# EAGLE design pager (EAGLE 7.7.0)
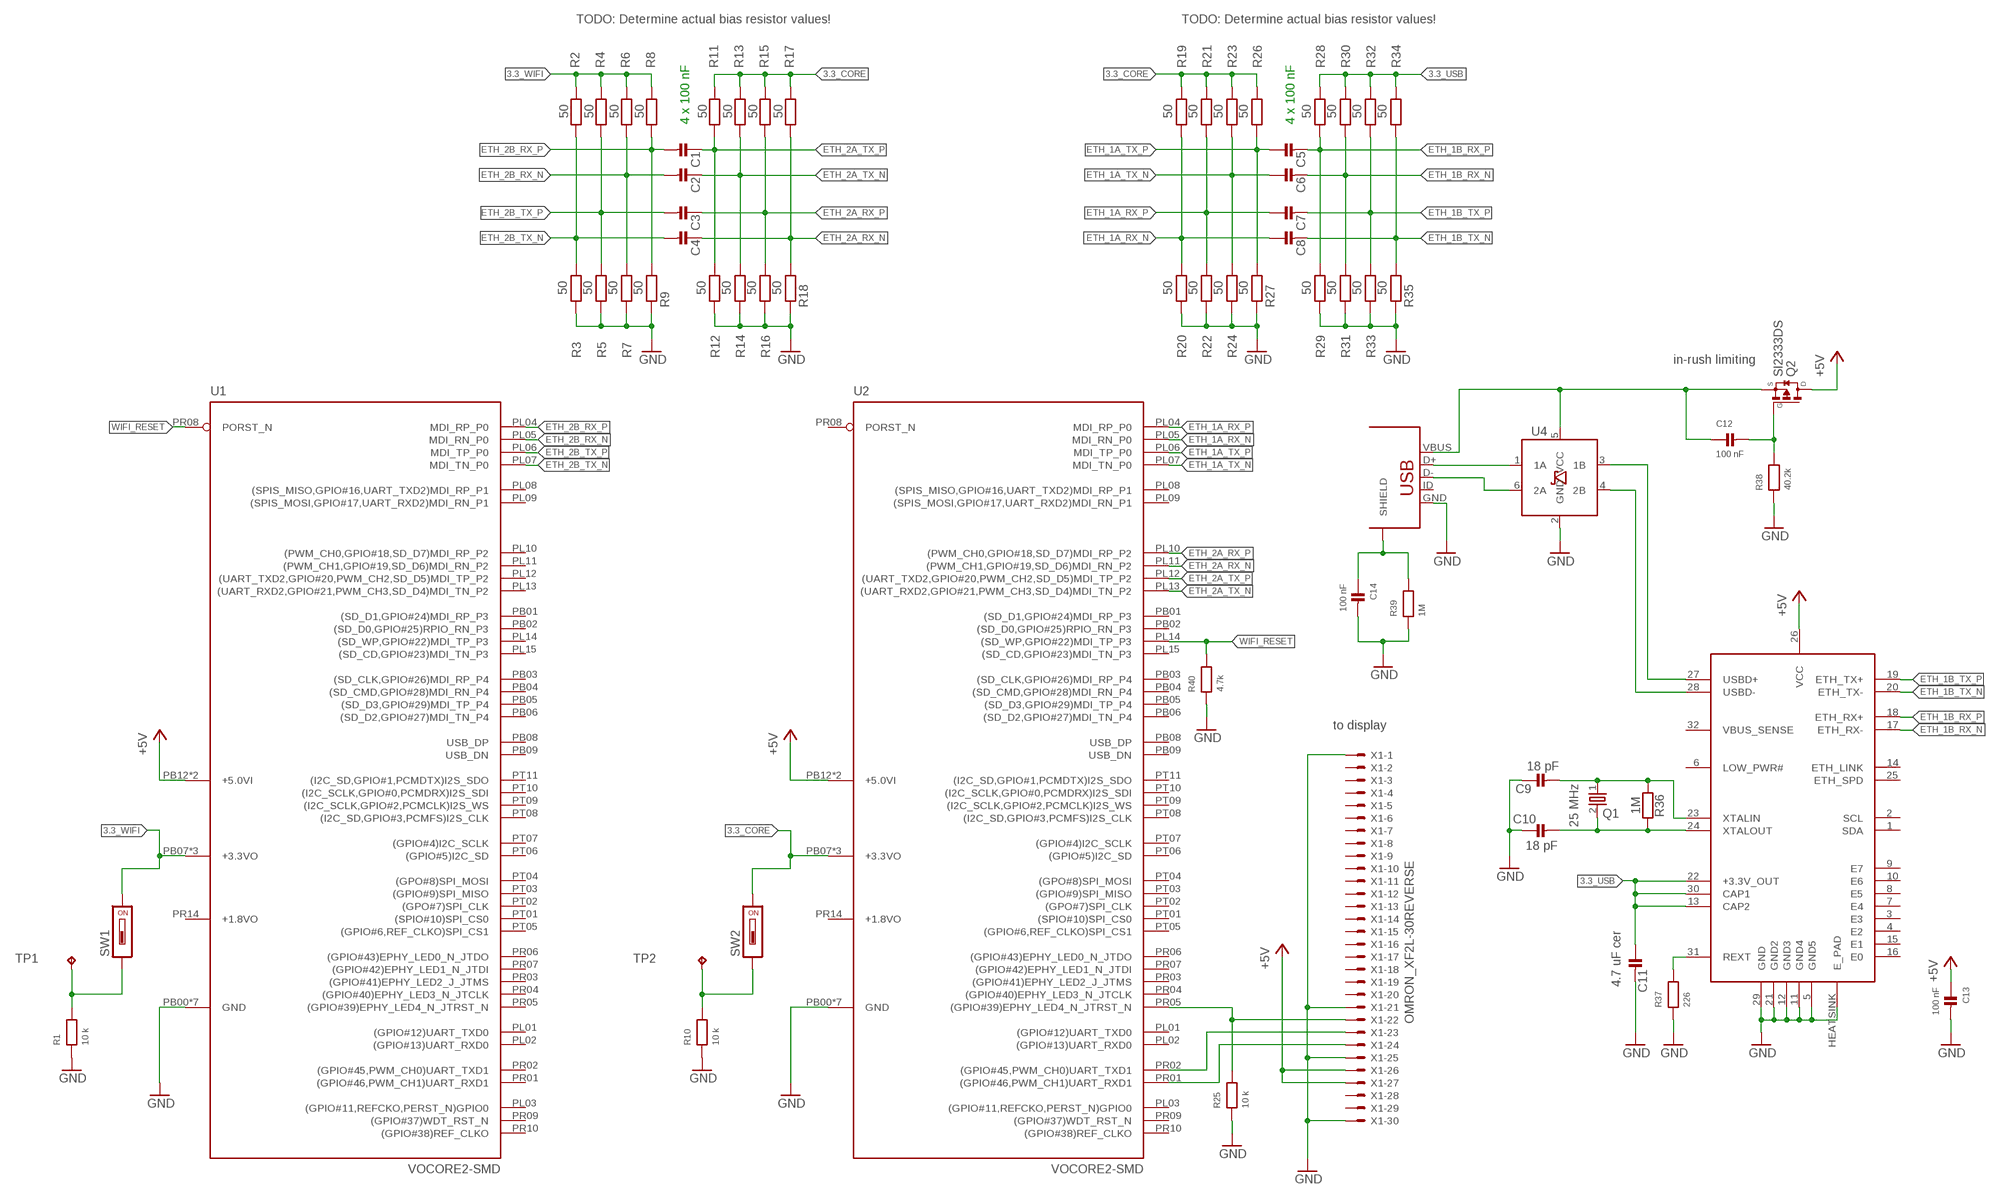
[diagram p0: schematic, sheet 1]

## Parts
C1  100 nF  CAP_CERAMIC_0402  [_0402]
C2  100 nF  CAP_CERAMIC_0402  [_0402]
C3  100 nF  CAP_CERAMIC_0402  [_0402]
C4  100 nF  CAP_CERAMIC_0402  [_0402]
C5  100 nF  CAP_CERAMIC_0402  [_0402]
C6  100 nF  CAP_CERAMIC_0402  [_0402]
C7  100 nF  CAP_CERAMIC_0402  [_0402]
C8  100 nF  CAP_CERAMIC_0402  [_0402]
C9  18 pF  CAP_CERAMIC_0402  [_0402]
C10  18 pF  CAP_CERAMIC_0402  [_0402]
C11  4.7 uF cer  CAP_CERAMIC_0603  [_0603]
C12  100 nF  CAP_CERAMIC_0402  [_0402]
C13  100 nF  CAP_CERAMIC_0402  [_0402]
C14  100 nF  CAP_CERAMIC_0402  [_0402]
Q1  25 MHz  XTAL-ABM3  [ABM3]
Q2  SI2333DS  [SOT23]
R1  10 k  RESISTOR_0402  [_0402]
R2  50  RESISTOR_0402  [_0402]
R3  50  RESISTOR_0402  [_0402]
R4  50  RESISTOR_0402  [_0402]
R5  50  RESISTOR_0402  [_0402]
R6  50  RESISTOR_0402  [_0402]
R7  50  RESISTOR_0402  [_0402]
R8  50  RESISTOR_0402  [_0402]
R9  50  RESISTOR_0402  [_0402]
R10  10 k  RESISTOR_0402  [_0402]
R11  50  RESISTOR_0402  [_0402]
R12  50  RESISTOR_0402  [_0402]
R13  50  RESISTOR_0402  [_0402]
R14  50  RESISTOR_0402  [_0402]
R15  50  RESISTOR_0402  [_0402]
R16  50  RESISTOR_0402  [_0402]
R17  50  RESISTOR_0402  [_0402]
R18  50  RESISTOR_0402  [_0402]
R19  50  RESISTOR_0402  [_0402]
R20  50  RESISTOR_0402  [_0402]
R21  50  RESISTOR_0402  [_0402]
R22  50  RESISTOR_0402  [_0402]
R23  50  RESISTOR_0402  [_0402]
R24  50  RESISTOR_0402  [_0402]
R25  10 k  RESISTOR_0402  [_0402]
R26  50  RESISTOR_0402  [_0402]
R27  50  RESISTOR_0402  [_0402]
R28  50  RESISTOR_0402  [_0402]
R29  50  RESISTOR_0402  [_0402]
R30  50  RESISTOR_0402  [_0402]
R31  50  RESISTOR_0402  [_0402]
R32  50  RESISTOR_0402  [_0402]
R33  50  RESISTOR_0402  [_0402]
R34  50  RESISTOR_0402  [_0402]
R35  50  RESISTOR_0402  [_0402]
R36  1M  RESISTOR_0402  [_0402]
R37  226  RESISTOR_0402  [_0402]
R38  40.2k  RESISTOR_0402  [_0402]
R39  1M  RESISTOR_0402  [_0402]
R40  4.7k  RESISTOR_0402  [_0402]
SW1  CHS-01A1  [CHS-01A1]
SW2  CHS-01A1  [CHS-01A1]
TP1  TPTP16SQ  [TP16SQ]
TP2  TPTP16SQ  [TP16SQ]
U1  VOCORE2-SMD  [VOCORE2-SMD]
U2  VOCORE2-SMD  [VOCORE2-SMD]
U3  XR22800IL  [QFN32]
U4  IP4234CZ6  [TSOP-6]
X1  OMRON_XF2L-30REVERSE  [OMRON_XF2L-30]
X2  FCI_8193_MICRO_USB  [FCI_MICRO_USB_8193]

## Nets
3.3_CORE: R11.2 R13.2 R15.2 R17.2 R19.2 R21.2 R23.2 R26.2 SW2.2 U2.PB07(+3.3VO) U2.PL00(+3.3VO) U2.PR11(+3.3VO)
3.3_USB: C11.1 R28.2 R30.2 R32.2 R34.2 U3.13(CAP2) U3.22(+3.3V_OUT) U3.30(CAP1)
3.3_WIFI: R2.2 R4.2 R6.2 R8.2 SW1.2 U1.PB07(+3.3VO) U1.PL00(+3.3VO) U1.PR11(+3.3VO)
+5V [power]: C13.1 Q2.3(D) U1.PB12(+5.0VI) U1.PB13(+5.0VI) U2.PB12(+5.0VI) U2.PB13(+5.0VI) U3.26(VCC) X1.4 X1.5
DISP_RESET: R25.2 U2.PR05((GPIO#39)EPHY_LED4_N_JTRST_N) X1.9
DISP_RX0: U2.PR02((GPIO#45,PWM_CH0)UART_TXD1) X1.8
DISP_TX0: U2.PR01((GPIO#46,PWM_CH1)UART_RXD1) X1.7
ETH_1A_RX_N [ethernet]: C8.1 R19.1 R20.2 U2.PL05(MDI_RN_P0)
ETH_1A_RX_P [ethernet]: C7.1 R21.1 R22.2 U2.PL04(MDI_RP_P0)
ETH_1A_TX_N [ethernet]: C6.1 R23.1 R24.2 U2.PL07(MDI_TN_P0)
ETH_1A_TX_P [ethernet]: C5.1 R26.1 R27.2 U2.PL06(MDI_TP_P0)
ETH_1B_RX_N [ethernet]: C6.2 R30.1 R31.2 U3.17(ETH_RX-)
ETH_1B_RX_P [ethernet]: C5.2 R28.1 R29.2 U3.18(ETH_RX+)
ETH_1B_TX_N [ethernet]: C8.2 R34.1 R35.2 U3.20(ETH_TX-)
ETH_1B_TX_P [ethernet]: C7.2 R32.1 R33.2 U3.19(ETH_TX+)
ETH_2A_RX_N [ethernet]: C4.1 R17.1 R18.2 U2.PL11((PWM_CH1,GPIO#19,SD_D6)MDI_RN_P2)
ETH_2A_RX_P [ethernet]: C3.1 R15.1 R16.2 U2.PL10((PWM_CH0,GPIO#18,SD_D7)MDI_RP_P2)
ETH_2A_TX_N [ethernet]: C2.1 R13.1 R14.2 U2.PL13((UART_RXD2,GPIO#21,PWM_CH3,SD_D4)MDI_TN_P2)
ETH_2A_TX_P [ethernet]: C1.1 R11.1 R12.2 U2.PL12((UART_TXD2,GPIO#20,PWM_CH2,SD_D5)MDI_TP_P2)
ETH_2B_RX_N [ethernet]: C2.2 R6.1 R7.2 U1.PL05(MDI_RN_P0)
ETH_2B_RX_P [ethernet]: C1.2 R8.1 R9.2 U1.PL04(MDI_RP_P0)
ETH_2B_TX_N [ethernet]: C4.2 R2.1 R3.2 U1.PL07(MDI_TN_P0)
ETH_2B_TX_P [ethernet]: C3.2 R4.1 R5.2 U1.PL06(MDI_TP_P0)
GND [power]: C9.1 C10.1 C11.2 C13.2 C14.2 R1.1 R3.1 R5.1 R7.1 R9.1 R10.1 R12.1 R14.1 R16.1 R18.1 R20.1 R22.1 R24.1 R25.1 R27.1 R29.1 R31.1 R33.1 R35.1 R37.1 R38.1 R39.1 R40.1 U1.PB00(GND) U1.PB10(GND) U1.PB11(GND) U1.PR00(GND) U1.PR12(GND) U1.PR13(GND) U1.PT00(GND) U2.PB00(GND) U2.PB10(GND) U2.PB11(GND) U2.PR00(GND) U2.PR12(GND) U2.PR13(GND) U2.PT00(GND) U3.5(GND5) U3.11(GND4) U3.12(GND3) U3.21(GND2) U3.29(GND) U3.HEATSINK(E_PAD) U4.2(GND) X1.1 X1.6 X1.10 X1.30 X2.GND
N$21: R37.2 U3.31(REXT)
N$22: C10.2 Q1.2 R36.2 U3.24(XTALOUT)
N$23: C9.2 Q1.1 R36.1 U3.23(XTALIN)
N$28: C12.2 Q2.1(G) R38.2
RAW_+5V [power]: C12.1 Q2.2(S) U4.5(VCC) X2.VBUS
SHIELD: C14.1 R39.2 X2.MNT1(SHIELD) X2.MNT2(SHIELD) X2.MNT3(SHIELD) X2.MNT4(SHIELD) X2.P$1(SHIELD) X2.P$2(SHIELD)
USB_N [usb]: U3.28(USBD-) U4.4(2B)
USB_P [usb]: U3.27(USBD+) U4.3(1B)
USB_RAW_N [usb]: U4.6(2A) X2.D-
USB_RAW_P [usb]: U4.1(1A) X2.D+
WIFI_RESET: R40.2 U1.PR08(PORST_N) U2.PL14((SD_WP,GPIO#22)MDI_TP_P3)
WP_CORE: R10.2 SW2.1 TP2.TP
WP_WIFI: R1.2 SW1.1 TP1.TP
Unconnected: U1.PB01((SD_D1,GPIO#24)MDI_RP_P3) U1.PB02((SD_D0,GPIO#25)RPIO_RN_P3) U1.PB03((SD_CLK,GPIO#26)MDI_RP_P4) U1.PB04((SD_CMD,GPIO#28)MDI_RN_P4) U1.PB05((SD_D3,GPIO#29)MDI_TP_P4) U1.PB06((SD_D2,GPIO#27)MDI_TN_P4) U1.PB08(USB_DP) U1.PB09(USB_DN) U1.PL01((GPIO#12)UART_TXD0) U1.PL02((GPIO#13)UART_RXD0) U1.PL03((GPIO#11,REFCKO,PERST_N)GPIO0) U1.PL08((SPIS_MISO,GPIO#16,UART_TXD2)MDI_RP_P1) U1.PL09((SPIS_MOSI,GPIO#17,UART_RXD2)MDI_RN_P1) U1.PL10((PWM_CH0,GPIO#18,SD_D7)MDI_RP_P2) U1.PL11((PWM_CH1,GPIO#19,SD_D6)MDI_RN_P2) U1.PL12((UART_TXD2,GPIO#20,PWM_CH2,SD_D5)MDI_TP_P2) U1.PL13((UART_RXD2,GPIO#21,PWM_CH3,SD_D4)MDI_TN_P2) U1.PL14((SD_WP,GPIO#22)MDI_TP_P3) U1.PL15((SD_CD,GPIO#23)MDI_TN_P3) U1.PR01((GPIO#46,PWM_CH1)UART_RXD1) U1.PR02((GPIO#45,PWM_CH0)UART_TXD1) U1.PR03((GPIO#41)EPHY_LED2_J_JTMS) U1.PR04((GPIO#40)EPHY_LED3_N_JTCLK) U1.PR05((GPIO#39)EPHY_LED4_N_JTRST_N) U1.PR06((GPIO#43)EPHY_LED0_N_JTDO) U1.PR07((GPIO#42)EPHY_LED1_N_JTDI) U1.PR09((GPIO#37)WDT_RST_N) U1.PR10((GPIO#38)REF_CLKO) U1.PR14(+1.8VO) U1.PT01((SPIO#10)SPI_CS0) U1.PT02((GPO#7)SPI_CLK) U1.PT03((GPIO#9)SPI_MISO) U1.PT04((GPO#8)SPI_MOSI) U1.PT05((GPIO#6,REF_CLKO)SPI_CS1) U1.PT06((GPIO#5)I2C_SD) U1.PT07((GPIO#4)I2C_SCLK) U1.PT08((I2C_SD,GPIO#3,PCMFS)I2S_CLK) U1.PT09((I2C_SCLK,GPIO#2,PCMCLK)I2S_WS) U1.PT10((I2C_SCLK,GPIO#0,PCMDRX)I2S_SDI) U1.PT11((I2C_SD,GPIO#1,PCMDTX)I2S_SDO) U2.PB01((SD_D1,GPIO#24)MDI_RP_P3) U2.PB02((SD_D0,GPIO#25)RPIO_RN_P3) U2.PB03((SD_CLK,GPIO#26)MDI_RP_P4) U2.PB04((SD_CMD,GPIO#28)MDI_RN_P4) U2.PB05((SD_D3,GPIO#29)MDI_TP_P4) U2.PB06((SD_D2,GPIO#27)MDI_TN_P4) U2.PB08(USB_DP) U2.PB09(USB_DN) U2.PL01((GPIO#12)UART_TXD0) U2.PL02((GPIO#13)UART_RXD0) U2.PL03((GPIO#11,REFCKO,PERST_N)GPIO0) U2.PL08((SPIS_MISO,GPIO#16,UART_TXD2)MDI_RP_P1) U2.PL09((SPIS_MOSI,GPIO#17,UART_RXD2)MDI_RN_P1) U2.PL15((SD_CD,GPIO#23)MDI_TN_P3) U2.PR03((GPIO#41)EPHY_LED2_J_JTMS) U2.PR04((GPIO#40)EPHY_LED3_N_JTCLK) U2.PR06((GPIO#43)EPHY_LED0_N_JTDO) U2.PR07((GPIO#42)EPHY_LED1_N_JTDI) U2.PR08(PORST_N) U2.PR09((GPIO#37)WDT_RST_N) U2.PR10((GPIO#38)REF_CLKO) U2.PR14(+1.8VO) U2.PT01((SPIO#10)SPI_CS0) U2.PT02((GPO#7)SPI_CLK) U2.PT03((GPIO#9)SPI_MISO) U2.PT04((GPO#8)SPI_MOSI) U2.PT05((GPIO#6,REF_CLKO)SPI_CS1) U2.PT06((GPIO#5)I2C_SD) U2.PT07((GPIO#4)I2C_SCLK) U2.PT08((I2C_SD,GPIO#3,PCMFS)I2S_CLK) U2.PT09((I2C_SCLK,GPIO#2,PCMCLK)I2S_WS) U2.PT10((I2C_SCLK,GPIO#0,PCMDRX)I2S_SDI) U2.PT11((I2C_SD,GPIO#1,PCMDTX)I2S_SDO) U3.1(SDA) U3.2(SCL) U3.3(E3) U3.4(E2) U3.6(LOW_PWR#) U3.7(E4) U3.8(E5) U3.9(E7) U3.10(E6) U3.14(ETH_LINK) U3.15(E1) U3.16(E0) U3.25(ETH_SPD) U3.32(VBUS_SENSE) X1.2 X1.3 X1.11 X1.12 X1.13 X1.14 X1.15 X1.16 X1.17 X1.18 X1.19 X1.20 X1.21 X1.22 X1.23 X1.24 X1.25 X1.26 X1.27 X1.28 X1.29 X2.ID

## Notes on the sheet
- TODO: Determine actual bias resistor values! | TODO: Determine actual bias resistor values!
- 4 x 100 nF | 4 x 100 nF
- in-rush limiting
- to display

## Library data of the parts
C1-C14 = pager:CAP_CERAMIC: Ceramic Capacitors 0402 - 0402 Surface Mount Capacitors 16pF 50V 5% [Digikey: 445-4899-2-ND] 18pF 50V 5% [Digikey: 490-1281-2-ND] 22pF 50V 5% [Digikey: 490-1283-2-ND] 68pF 50V 5% [Digikey: 490-1289-2-ND] 0.1uF 10V 10% [Digikey: 490-1318-2-ND] 1.0uF 6.3V 10% [Digikey: 490-1320-2-ND] 0603 - 0603 Surface Mount Capacitors 16 pF 50V 5% [Digikey: 445-5051-2-ND] 22 pF 50V [Digikey: PCC220ACVTR-ND] 33 pF 50V 5% [Digikey: 490-1415-1-ND] 56pF 50V 5% [Digikey: 490-1421-1-ND] 220pF 50V 5% [Digikey: 445-1285-1-ND] 680 pF 50V 2200 pF 50V 5% C0G [Digikey: 445-1297-1-ND] 5600 pF 100V 5% X7R [Digikey: 478-3711-1-ND] 0.1 µF 25V 10% [Digikey: PCC2277TR-ND] 0.22 µF 16V 10% X7R [Digikey: 445-1318-1-ND] 1.0 µF 25V 10% [Digikey: 445-5146-2-ND] 0603 - RF Specific 3pF 250V +/-0.1pF RF [Digikey: 712-1347-1-ND] 18 pF 250V 5% [Digikey: 478-3505-1-ND or 712-1322-1-ND] 56 pF 250V 5% C0G RF [Digikey: 490-4867-1-ND] 68 pF 250V RF [Digikey: 490-4868-1-ND] 0805 - 0805 Surface Mount Capacitors 220 pF 250V 2% RF Ceramic Capacitor [Digikey: 712-1398-1-ND] 1000 pF 50V 2% NP0 Ceramic Capacitor [Digikey: 478-3760-1-ND] 0.1 µF 25V 10% Ceramic Capacitor [Digikey: PCC1828TR-ND] 1.0 µF 16V 10% Ceramic Capacitor[Digikey: 490-1691-2-ND] 10.0 µF 10V 10% Ceramic Capacitor[Digikey: 709-1228-1-ND] 10.0 uF 16V 10% Ceramic Capacitor [Digikey: 478-5165-2-ND] 47 uF 6.3V 20% Ceramic Capacitor [Digikey: 587-1779-1-ND or 399-5506-1-ND] 1206 - 1206 Surface Mount Capacitors 47uF 10V 20% Ceramic Capacitor [Digikey: 490-5528-1-ND or 399-5508-1-ND or 445-6010-1-ND] 100uF 6.3V -20%, +80% Y5V Ceramic Capacitor (Digikey: 490-4512-1-ND, Mouser: 81-GRM31CF50J107ZE1L) 1810 - 1810 Surface Mount Capacitors High volt MLC; no solder stop between for higher isolation
Q1 = pager:XTAL
Q2 = pager:SI2333DS: P-Channel MOSFET
R1-R40 = pager:RESISTOR: Resistors 0402 - 0402 Surface Mount Package 22 Ohm 1% 1/16W [Digikey: 311-22.0LRTR-ND] 33 Ohm 5% 1/16W 1.0K 5% 1/16W 1.5K 5% 1/16W 2.0K 1% 1/16W 10.0K 1% 1/16W [Digikey: 311-10.0KLRTR-ND] 10.0K 5% 1/16W [Digikey: RMCF0402JT10K0TR-ND] 12.1K 1% 1/16W [Digikey: 311-22.0LRTR-ND] 100.0K 5% 1/16W 0603 - 0603 Surface Mount Package 1/10 Watt 0805 - 0805 Surface Mount Package 1/8 Watt 1206 - 1206 Surface Mount Package 2012 - 2010 Surface Mount Package 0.11 Ohm 1/2 Watt 1% Resistor - Digikey: RHM.11UCT-ND
SW1 SW2 = pager:CHS-01A1
TP1 TP2 = pager:TP: Test pad
U1 U2 = pager:VOCORE2-SMD
U3 = pager:XR22800IL
U4 = pager:IP4234CZ6: NXP IP4234CZ6 - Single USB 2.0 ESD protection to IEC 61000-4-2 level 4; OC_DIGIKEY: 568-5869-1-ND
X1 = pager:OMRON_XF2L-30: FFC/FPC-to-Board 0.50mm (.020") SMT Top Contact Right Angle, ZIF, Style Receptacle 52745 / 52435 Source: http://www.molex.com/product/ffc/52745.html
X2 = pager:FCI_8193_MICRO_USB

## Board
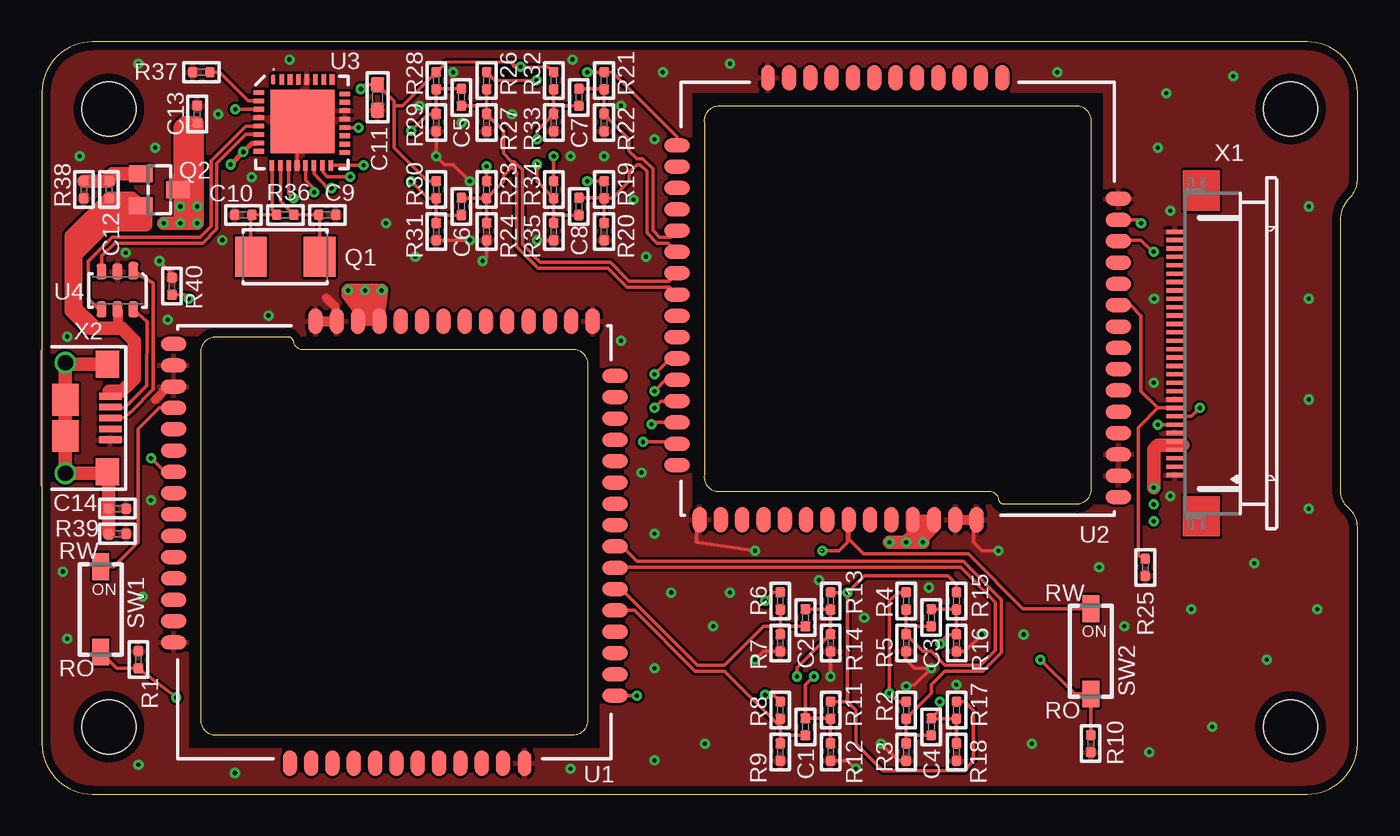
[diagram p1: board, top side]
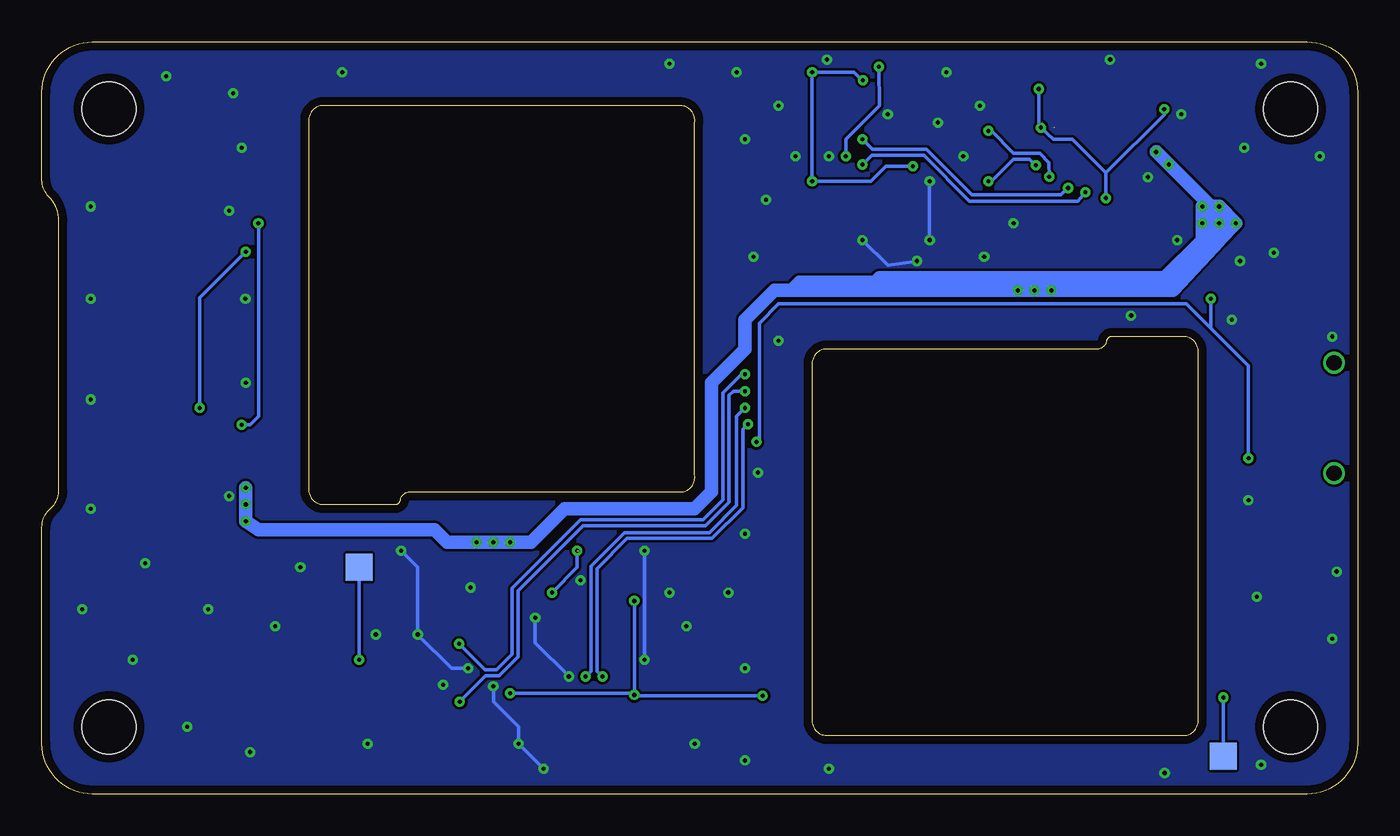
[diagram p2: board, bottom side, seen from below]

Size 78.4 x 44.8 mm. Coordinates in mm from the lower left corner, seen from the top.
Outline: 78.4,3 78.4,15.88 arc45 77.97,16.93 77.84,17.06 arc-45 77.4,18.02 77.4,34.17 arc-45 77.99,35.59 arc45 78.4,36.58 78.4,41.8 arc90 75.4,44.8 3,44.8 arc90 0,41.8 0,3 arc90 3,0 75.4,0 arc90 78.4,3
Copper layers (1*16): Top 0.035mm / dielectric 1.5mm / Bottom 0.035mm
Design rules "basista_035um-cu_dicke *": minimum track width 0.2mm, minimum drill 0.25mm, track to track 6mil, track to pad 6mil, pad to pad 6mil, via to via 6mil, smd to smd 6mil, copper to edge 20mil, drill to drill 8mil, minimum pad ring 8mil, minimum via ring 6mil, stop-mask expansion 3mil, vias tented up to drill 0mil, thermal gap 8mil
Holes 3.2 mm at 4,4 4,40.8 74.4,40.8 74.4,4

### Footprints (pad centres in the part's own frame; a part is rotated, then mirrored left to right if it is on the bottom)
_0402 = smd 0.6 x 0.6: 1 -0.508,0; 2 0.508,0
_0603 = smd 0.9 x 0.8: 1 -0.762,0; 2 0.762,0
ABM3 = smd 1.9 x 2.4: 1 -2.05,0; 2 2.05,0
SOT23 = smd 1 x 1.4: 1 -0.95,-1.1; 2 0.95,-1.1; 3 0,1.1
CHS-01A1 = smd 1 x 1.6: 1 0,-2.54; 2 0,2.54
TP16SQ = smd 1.6 x 1.6: TP 0,0
VOCORE2-SMD = smd 0.838 x 1.524: PB00 -11.811,-13.157; PB01 -10.541,-13.157; PB02 -9.271,-13.157; PB03 -8.001,-13.157; PB04 -6.731,-13.157; PB05 -5.461,-13.157; PB06 -4.191,-13.157; PB07 -2.921,-13.157; PB08 -1.651,-13.157; PB09 -0.381,-13.157; PB10 3.429,-13.157; PB11 4.699,-13.157; PB12 0.889,-13.157; PB13 2.159,-13.157; PT01 -6.477,13.157; PT02 -5.207,13.157; PT03 -3.937,13.157; PT04 -2.667,13.157; PT05 -1.397,13.157; PT06 -0.127,13.157; PT07 1.143,13.157; PT08 2.413,13.157; PT09 3.683,13.157; PT10 4.953,13.157; PT11 6.223,13.157 | smd 1.524 x 0.838: PL00 -13.157,9.144; PL01 -13.157,7.874; PL02 -13.157,6.604; PL03 -13.157,5.334; PL04 -13.157,4.064; PL05 -13.157,2.794; PL06 -13.157,1.524; PL07 -13.157,0.254; PL08 -13.157,-1.016; PL09 -13.157,-2.286; PL10 -13.157,-3.556; PL11 -13.157,-4.826; PL12 -13.157,-6.096; PL13 -13.157,-7.366; PL14 -13.157,-8.636; PL15 -13.157,-9.906; PR00 13.157,5.969; PR01 13.157,4.699; PR02 13.157,3.429; PR03 13.157,2.159; PR04 13.157,0.889; PR05 13.157,-0.381; PR06 13.157,-1.651; PR07 13.157,-2.921; PR08 13.157,-4.191; PR09 13.157,-5.461; PR10 13.157,-6.731; PR11 13.157,-8.001; PR12 13.157,-9.271; PR13 13.157,-10.541; PR14 13.157,-11.811 | smd 0.813 x 1.524: PT00 -7.747,13.157
QFN32 = smd 0.275 x 0.625: 1 -1.71,2.56; 2 -1.21,2.56; 3 -0.71,2.56; 4 -0.21,2.56; 5 0.29,2.56; 6 0.79,2.56; 7 1.29,2.56; 8 1.79,2.56; 17 1.71,-2.56; 18 1.21,-2.56; 19 0.71,-2.56; 20 0.21,-2.56; 21 -0.29,-2.56; 22 -0.79,-2.56; 23 -1.29,-2.56; 24 -1.79,-2.56 | smd 0.625 x 0.275: 9 2.56,1.71; 10 2.56,1.21; 11 2.56,0.71; 12 2.56,0.21; 13 2.56,-0.29; 14 2.56,-0.79; 15 2.56,-1.29; 16 2.56,-1.79; 25 -2.56,-1.71; 26 -2.56,-1.21; 27 -2.56,-0.71; 28 -2.56,-0.21; 29 -2.56,0.29; 30 -2.56,0.79; 31 -2.56,1.29; 32 -2.56,1.79 | smd 3.8 x 3.8: HEATSINK 0.04,0.06
TSOP-6 = smd 0.6 x 1.05: 1 -0.95,-1.175 | smd 0.6 x 0.95: 2 0,-1.125; 3 0.95,-1.125; 4 0.95,1.125; 5 0,1.125; 6 -0.95,1.125
OMRON_XF2L-30 = smd 0.25 x 1: 1 -7.25,2.5; 2 -6.75,2.5; 3 -6.25,2.5; 4 -5.75,2.5; 5 -5.25,2.5; 6 -4.75,2.5; 7 -4.25,2.5; 8 -3.75,2.5; 9 -3.25,2.5; 10 -2.75,2.5; 11 -2.25,2.5; 12 -1.75,2.5; 13 -1.25,2.5; 14 -0.75,2.5; 15 -0.25,2.5; 16 0.25,2.5; 17 0.75,2.5; 18 1.25,2.5; 19 1.75,2.5; 20 2.25,2.5; 21 2.75,2.5; 22 3.25,2.5; 23 3.75,2.5; 24 4.25,2.5; 25 4.75,2.5; 26 5.25,2.5; 27 5.75,2.5; 28 6.25,2.5; 29 6.75,2.5; 30 7.25,2.5
FCI_MICRO_USB_8193 = smd 0.4 x 1.35: D+ 0,2.675; D- -0.65,2.675; GND 1.3,2.675; ID 0.65,2.675; VBUS -1.3,2.675 | smd 1.6 x 1.4: MNT1 -3.2,2.5; MNT2 3.2,2.5 | smd 1.9 x 1.6: MNT3 -1.075,0; MNT4 1.075,0 | drill 0.9: P$1 -3.3,0; P$2 3.3,0

### Placement (x,y rotation side)
C1  45.5,4 270 top
C2  45.5,10.5 270 top
C3  53,10.5 270 top
C4  53,4 270 top
C5  25,41.5 90 top
C6  25,35 270 top
C7  32,41.5 270 top
C8  32,35 270 top
C9  17,34.5 180 top
C10  12,34.5 0 top
C11  20,41.5 270 top
C12  4,36 90 top
C13  9.25,40.5 90 top
C14  4.5,17 0 top
Q1  14.5,32 180 top
Q2  7,36 270 top
R1  5.75,8 270 top
R2  51.5,5 90 top
R3  51.5,2.5 90 top
R4  51.5,11.5 90 top
R5  51.5,9 90 top
R6  44,11.5 90 top
R7  44,9 90 top
R8  44,5 90 top
R9  44,2.5 90 top
R10  62.5,3 90 top
R11  47,5 90 top
R12  47,2.5 90 top
R13  47,11.5 90 top
R14  47,9 90 top
R15  54.5,11.5 90 top
R16  54.5,9 90 top
R17  54.5,5 90 top
R18  54.5,2.5 90 top
R19  33.5,36 90 top
R20  33.5,33.5 90 top
R21  33.5,42.5 90 top
R22  33.5,40 90 top
R23  26.5,36 90 top
R24  26.5,33.5 90 top
R25  65.75,13.5 90 top
R26  26.5,42.5 90 top
R27  26.5,40 90 top
R28  23.5,42.5 90 top
R29  23.5,40 90 top
R30  23.5,36 90 top
R31  23.5,33.5 90 top
R32  30.5,42.5 90 top
R33  30.5,40 90 top
R34  30.5,36 90 top
R35  30.5,33.5 90 top
R36  14.5,34.5 180 top
R37  9.5,43 0 top
R38  2.5,36 90 top
R39  4.5,15.5 180 top
R40  7.75,30.25 270 top
SW1  3.5,11 0 top
SW2  62.5,8.5 0 top
TP1  8,2.25 0 bottom
TP2  59.5,13.5 0 bottom
U1  21,15 180 top
U2  51,29.5 0 top
U3  15.5,40 0 top
U4  4.5,30 180 top
X1  70,26.25 90 top
X2  1.4,22.4 270 top

### Tracks (layer width: path | path; a pad name or v marks a point on that pad's centre or on a via)
3.3_CORE  (via drill 0.25 pad 0.6)  (1 unrouted)
  Top 0.2: U2.PL00 37.84,39.16 34,43 R21.2 v32.51,43.01 v32.5,43 | v48,12 R13.2 | R15.2 54.5,12.5 54,13 49,13 v48,12 | R11.2 48,5.5 | 48,5.5 v48,12 | 48,5.5 48.5,5 48.5,3 50.12,1.4 55,1.4 55.5,2 55.5,5 55,5.5 R17.2 | SW2.2 58.46,11.04 55.2,14.3 48.95,14.3 48.08,15.17 U2.PB07 48,16.26 48,15 47.5,14.5 v46.5,14.5 | 46.6,14.3 46.4,14.5 | R23.2 v26.5,37.4 | v29.48,42.52 27,42.5 R26.2 | R19.2 v32.51,36.51 v32.5,36.5
  Bottom 0.2: v46.5,14.5 46.5,13.5 v48,12 | v26.5,37.4 28.1,37.4 29,36.5 v32.5,36.5 v32.5,43 30,43 29.52,42.52 v29.48,42.52
3.3_USB  (via drill 0.25 pad 0.6)  (1 unrouted)
  Top 0.2: R30.2 22.99,36.51 21,38.5 21,41 | 21,41 21.49,41 R28.2 24.12,43.6 27.98,43.62 28.18,43.33 v28.52,43.33 30.18,43.3 R32.2 | v18.88,39.7 U3.13 | U3.22 14.71,35.79 v15,35.5 | v11.53,40.8 v11.54,40.79 U3.30 | R34.2 v30.5,38 | v19,42 19.26,42.26 C11.1 21,41.26 21,41
  Bottom 0.2: v15,35.5 15,37 | 15,37 17,39 18.12,39 v18.88,39.7 19,39.83 v19,42 | v30.5,38 30.5,39 28.5,41 v28.52,43.33 | 15,37 11.53,40.48 v11.53,40.8
3.3_WIFI  (via drill 0.25 pad 0.6)
  Top 0.2: R2.2 51,5.5 v50.5,6 50.5,11.5 51,12 R4.2 | U1.PL00 v35.44,5.86 v35.45,5.85 | v43.1,5.9 43.61,5.9 R8.2 | R6.2 43.61,12.01 v43.1,11.5 | U1.PR11 7,23 5.75,21.75 5.75,15 4.29,13.54 SW1.2
  Bottom 0.2: v35.45,5.85 43.05,5.85 v43.1,5.9 | v43.1,11.5 v43.1,5.9 | v50.5,6 43.2,6 v43.1,5.9
+5V  (via drill 0.25 pad 0.6)
  Top 0.2: 67.99,20.76 67.99,20.74 67.75,20.5 X1.4 X1.5 | U3.26 12.9,38.75 12.75,38.75
  Top 0.3: 12.75,38.75 12.5,38.75 v12,38.25 v11.25,37.5
  Top 0.6: U1.PB12 U1.PB13 | U2.PB13 U2.PB12
  Top 0.8: v66.25,18.25 66.25,20.5 66.51,20.76 67.99,20.76 | v51.5,15 51.89,15.39 U2.PB12 | v50.5,15 v52.5,15 | v52.5,15 52.5,16.25 | v52.5,15 52.5,15.29 53.16,15.95 | U1.PB13 19,28.32 19,28.75 | 19,28.75 v19.25,30 | 19.5,30 v18.25,30 18.25,29.75 19,28.75 | 19.5,30 v20.25,30 20,28.25 19.5,28.75 19.5,30 | v8.25,35 v8.25,34 | v8.25,34 v7.25,34 | v8.25,35 8.25,35.85 Q2.3 8.25,37 8.25,39.75 8.5,40 8.51,39.99 C13.1 | v8.25,35 v9.25,35 | v9.25,35 v9.25,34 v8.25,34 | v8.25,34 8.75,34 8.75,34.75 | 8.25,36 v9.25,35 | v9.25,35 C13.1 9,40 8.75,39.75 8.75,36
  Bottom 0.3: 8.75,35 v11.25,37.5 v12,38.25
  Bottom 0.8: v8.25,34 8.25,33.99 | 8.25,33.99 8.25,33 | 8.25,33 11,30 v18.25,30 v19.25,30 v20.25,30 34.75,30 36.5,28.25 36.5,26.5 38.5,24.5 38.5,18 39.5,17 47.25,17 49.25,15 v50.5,15 v51.5,15 v52.5,15 54.25,15 55,15.75 65.5,15.75 v66.25,16.25 v66.25,17.25 v66.25,18.25 | v8.25,34 v8.25,35 | 8.25,33.99 8.24,34 v7.25,34 | v8.25,35 v7.25,34 | v7.25,34 8.25,33 | v8.25,35 8.75,35 | 8.75,35 v9.25,35 v9.25,34 | v9.25,34 v8.25,34 | v8.25,34 8.75,34 8.75,35 | 9.25,32 9.25,33 | 9.25,33 8.75,33 8.75,33.5 | v12,38.25 8.75,35 | v9.25,34 9.25,33 | 9.25,33 11.5,30.75 28.5,30.75 28.75,30.5 33.25,30.5 33.5,30.25 | v8.25,34 8.25,33.5 11.25,30.5
DISP_RESET
  Top 0.2: R25.2 65.33,14.18 65.33,21.82 66.5,23 | 66.5,23 X1.9 | U2.PR05 64.88,29.12 65.5,28.5 65.5,24 66.5,23
DISP_RX0  (via drill 0.25 pad 0.6)
  Top 0.2: X1.8 68.5,22.5 v69,23 | v66.25,32.3 66.2,32.3 65.5,33 64.23,33 U2.PR02
  Bottom 0.2: v69,23 69,29.55 v66.25,32.3
DISP_TX0  (via drill 0.25 pad 0.6)
  Top 0.2: U2.PR01 65.3,34.2 v65.5,34 | v66.5,22 X1.7
  Bottom 0.2: v65.5,34 65.5,22.5 66,22 v66.5,22
ETH_1A_RX_N
  Top 0.2: C8.1 33.48,35.51 R19.1 | R19.1 R20.2 | U2.PL05 37.31,32.82 36.65,32.82 36.05,33.43 36.05,37.1 35.65,37.5 35.45,37.5 35,37.05 35,36.5 33.99,35.49 R19.1
ETH_1A_RX_P
  Top 0.2: C7.1 33.48,42.01 R21.1 R22.2 35,39 35,38.3 35.45,37.85 35.8,37.85 36.4,37.25 36.4,33.57 36.8,33.18 37.45,33.18 U2.PL04
ETH_1A_TX_N
  Top 0.2: R23.1 25.02,35.49 C6.1 | R23.1 R24.2 | U2.PL07 37.4,30.2 34.85,30.2 33.73,31.32 29.55,31.32 28.27,32.6 28.27,37.05 28,37.32 27.5,36.82 27.5,36.5 R23.1
ETH_1A_TX_P
  Top 0.2: 26.5,41 R27.2 27.5,39.5 27.5,38.18 28,37.68 28.15,37.68 28.63,37.2 28.63,32.75 29.7,31.68 33.87,31.68 35,30.55 37.37,30.55 U2.PL06 | 26.5,41 R26.1 | C5.1 26.49,40.99 26.5,41
ETH_1B_RX_N  (via drill 0.25 pad 0.6)
  Top 0.2: C6.2 23.5,34.49 | 23.5,34.49 R30.1 23,35.5 v22,36.5 | R31.2 23.5,34.49 | v19.18,37.45 U3.17
  Bottom 0.2: v22,36.5 21.82,36.5 20.5,37.82 19.55,37.82 v19.18,37.45
ETH_1B_RX_P  (via drill 0.25 pad 0.6)
  Top 0.2: C5.2 23.52,42.01 R28.1 R29.2 23,40.5 v22,39.5 | U3.18 16.73,37.42 16.73,37.17 16.75,37.15 16.75,37.05 17,36.77 v18.38,36.77
  Bottom 0.2: v18.38,36.77 18.39,37.62 18.93,38.18 20.5,38.18 21.82,39.5 v22,39.5
ETH_1B_TX_N  (via drill 0.25 pad 0.6)
  Top 0.2: R35.2 30.5,34.49 | 30.5,34.49 R34.1 29.5,36.49 v29.5,37.5 | C8.2 30.5,34.49 | U3.20 15.72,37.42 15.72,36.55 16.23,36.05 v16.23,35.85
  Bottom 0.2: v29.5,37.5 28.95,38.05 25.85,38.05 23.12,35.32 16.68,35.32 v16.23,35.85
ETH_1B_TX_P  (via drill 0.25 pad 0.6)
  Top 0.2: C7.2 30.5,40.99 R33.2 | R33.2 R32.1 | R33.2 29.5,39.51 v29.5,39 | U3.19 16.23,37.42 16.23,36.95 17.01,36.1 v17.25,36.1
  Bottom 0.2: v29.5,39 28.9,38.4 25.7,38.4 22.98,35.7 17.88,35.7 17.7,35.7 17.68,35.7 v17.25,36.1
ETH_2A_RX_N  (via drill 0.25 pad 0.6)
  Top 0.2: 53,4.49 C4.1 | R18.2 R17.1 53.02,4.49 C4.1 | U2.PL11 37.17,24.67 v36.5,24 | v53.5,5.5 53.5,5.01 C4.1
  Bottom 0.2: v36.5,24 37.2,24 | 37.2,24 | 37.2,24 37.45,23.75 37.45,17.38 38.85,15.97 46.15,15.97 50.02,12.1 50.02,8.18 51.15,7.05 51.95,7.05 v53.5,5.5
ETH_2A_RX_P  (via drill 0.25 pad 0.6)
  Top 0.2: C3.1 54.5,11.01 R15.1 R16.2 54,9.5 53.55,9.05 v53.55,8.95 | U2.PL10 37.44,25.94 v36.5,25
  Bottom 0.2: v36.5,25 36.7,25 37.8,23.9 37.8,17.52 39,16.33 46.3,16.33 50.38,12.25 50.38,8.32 51.3,7.4 52,7.4 v53.55,8.95
ETH_2A_TX_N  (via drill 0.25 pad 0.6)
  Top 0.2: C2.1 45.5,10.99 R13.1 R14.2 45,7.51 v45,7 | 37.13,22.13 U2.PL13 36.43,22.13 v36.33,22.02
  Bottom 0.2: v36.33,22.02 36.62,21.73 36.62,17.05 38.48,15.22 43.53,15.22 45.32,13.43 45.32,7.32 v45,7
ETH_2A_TX_P  (via drill 0.25 pad 0.6)
  Top 0.2: R12.2 R11.1 46.98,4.51 C1.1 | U2.PL12 36.9,23.4 v36.5,23 | C1.1 | v46,7 45.5,6.5 C1.1
  Bottom 0.2: v36.5,23 37,22.5 37,17.2 38.62,15.58 43.67,15.58 45.68,13.57 45.68,7.32 v46,7
ETH_2B_RX_N
  Top 0.2: C2.2 44,9.99 R7.2 44,10 | 44,10 R6.1 | U1.PL05 34.54,12.21 39.07,7.68 40.68,7.68 43,10 44,10
ETH_2B_RX_P
  Top 0.2: C1.2 44,3.49 | 44,3.49 44,4 | 44,4 R8.1 | R9.2 44,3.49 | U1.PL04 35.31,10.94 38.93,7.32 40.68,7.32 44,4
ETH_2B_TX_N
  Top 0.2: R3.2 51.5,3.49 | 51.5,3.49 R2.1 53,5.99 53,6.5 53.82,7.32 56.07,7.32 57.18,8.43 57.18,11.57 54.9,13.85 35.48,13.85 34.58,14.75 U1.PL07 | C4.2 51.5,3.49
ETH_2B_TX_P
  Top 0.2: C3.2 51.5,9.99 R5.2 | R4.1 R5.2 | U1.PL06 34.45,13.48 34.48,13.5 54.75,13.5 56.82,11.43 56.82,8.57 55.93,7.68 53.82,7.68 53,8.5 52.51,8.5 R5.2
GND  (via drill 0.25 pad 0.6)
  Top 0.2: R29.1 v23.5,38 24,37.5 24.5,37.5 v25.5,36.5 | v25.5,33 R31.1 | R24.1 26.5,32 v26.25,31.75 | v29.5,33 R35.1 | R16.1 54.99,8.49 v56,9.5 | v57,14.5 56,14.5 55.5,15 55.5,16.14 U2.PB11 | R12.1 48.01,1.99 v48.5,1.5 | v50,3 51,2 R3.1 | R7.1 43.01,8.49 43,8.5 v42.5,8 | v42.5,14.5 39,15 39,16.15 U2.PB00 | R5.1 51.5,8 52,7.5 v53,7.5 52,6.5 v51.5,6.42 | U3.21 15.21,39.73 U3.HEATSINK | R14.1 v47,7 | R40.1 7.75,31 v7,31.75
  Top 0.5: 7.5,24.25 6.75,23.5 | 17.5,28.25 17.5,29 16.95,29.55 17.45,29.12
  Top 0.6: U1.PB11 17.34,28.16 17.5,28 | U2.PB10 55.34,16.34 55.5,16.5 | 17.5,28.25 17.5,28.5
  Bottom 0.2: v25.5,36.5 v25.5,33 | v26.25,31.75 28,31.5 v29.5,33 | v57,14.5 56,13.5 v56,9.5 54,7.5 v53,7.5 | v48.5,1.5 v50,3 50,4 51.5,5.5 v51.5,6.42 | v42.5,8 v42.5,14.5 | v47,7 49,9 v49,10.5
  other vias: 67,41.75 41,12 69.75,4 71,42.75 39.5,3 36.5,2 40,10 20.5,34 37,43 41,43.5 60.5,43 75.5,35 75.5,23.5 73,8 68.5,11 63,13.5 36.5,15.5 36.5,7.5 13.5,28.5 34.5,27 37.5,12 36.5,39 34.5,41 33.5,38 76,11 75.5,17 75.5,29.5 59,3 58.5,9.5 64.5,10 66,2.5 35.73,19.15 36,32 35.25,35.4 72.25,13.75 66.5,38.5 66.28,29.5 28,40.5 31.62,43.75 22.25,32 46.3,12.72 54.5,6.5 31.5,1.5 25,40 31.5,38 22.5,41 24.5,43 52.85,12.3 1.25,13.25 1.5,9.25 5.75,1.75 11.5,1.25 6.5,17.5 6,11.75 2.25,38 10.5,40.5 14.75,43.75 5,32.25 5.75,43.5 1.5,27.25 67.25,17.75 67.25,34.75 66.25,24.5 10.75,33 12.5,36.75 6.75,38.5 7.5,28.25
  pour Bottom: 75.28,0 2.92,0 arc-90 0,2.92 0,41.72 arc-90 3.08,44.8 75.42,44.8 arc-90 78.4,41.82 78.4,3.12 arc-90
  pour Top: 75.28,0 2.92,0 arc-90 0,2.92 0,41.75 arc-90 3.05,44.8 75.42,44.8 arc-90 78.4,41.82 78.4,3.12 arc-90
N$21
  Top 0.2: U3.31 12.29,41.3 10.59,43 R37.2
N$22
  Top 0.2: Q1.2 12.45,34.44 C10.2 R36.2 13.71,34.78 U3.24
N$23
  Top 0.2: U3.23 14.21,35.3 R36.1 C9.2 16.55,34.44 Q1.1
N$28
  Top 0.8: Q2.1 4.22,36.95 4,36.75 C12.2 R38.2
RAW_+5V
  Top 0.2: X2.VBUS 4.08,23.93 4,24 | 6.25,34.75 6.2,34.75 Q2.2 6.19,34.76 6.19,34.73
  Top 0.6: U4.5 4.5,27.75
  Top 0.8: 4,24 4.75,24 5.5,24.75 5.5,27 4.75,27.75 4.5,27.75 2.75,27.75 1.75,28.75 1.75,33.24 | 1.75,33.24 C12.1 5.34,35.49 Q2.2 5.69,35.05 5.59,34.95 4.88,34.95 2.01,32.09 | 4.56,35.09 4.24,35.09 2.04,32.89 2.04,32.99 2.02,33 | 3.1,27.85 2.02,28.93 2.02,33 | 2.02,33 2.02,33.2 1.98,33.24 1.75,33.24 | 6.19,34.73 6.17,33.92 | 6.16,33.94 6.17,33.92 | 6.17,33.92 3.74,33.92 4.19,34.38 6.06,34.38
SHIELD
  Top 0.8: X2.MNT1 1.5,25.6 X2.P$1 X2.MNT3 X2.MNT4 X2.P$2 3.8,19.1 | 3.8,19.1 X2.MNT2 | R39.2 C14.1 3.99,18.91 3.8,19.1
USB_N
  Top 0.2: U4.4 3.55,28.7 2.75,29.5 2.75,31.75 4.18,33.18 9.43,33.18 10.07,33.82 10.07,37.72 11.89,39.54 12.12,39.77 12.93,39.77 U3.28
USB_P
  Top 0.2: U4.3 3.55,32.05 4.32,32.82 9.57,32.82 10.43,33.68 10.43,37.58 12.14,39.29 U3.27
USB_RAW_N
  Top 0.2: U4.6 6.27,28.12 6.25,24.31 4.92,23 4.12,23 X2.D-
USB_RAW_P
  Top 0.2: U4.1 6.63,30.43 6.63,24.1 5.28,22.75 5.26,22.75 4.91,22.4 X2.D+
WIFI_RESET  (via drill 0.25 pad 0.6)
  Top 0.2: U1.PR08 7.31,19.19 v6.5,20 | v35.83,20.98 37.73,20.98 U2.PL14 | R40.2 8.51,29.74 v8.75,29.5
  Bottom 0.2: v6.5,20 6.5,25.5 8.62,27.62 8.75,27.75 | 8.75,27.75 10.2,29.2 34.5,29.2 35.65,28.05 35.65,21.15 v35.83,20.98 | v8.75,29.5 8.75,27.75
WP_CORE  (via drill 0.25 pad 0.6)
  Top 0.2: v59.5,8 61.54,5.96 SW2.1 R10.2
  Bottom 0.2: v59.5,8 TP2.TP
WP_WIFI  (via drill 0.25 pad 0.6)
  Top 0.2: SW1.1 4.47,7.49 R1.2 v8,5.75
  Bottom 0.2: v8,5.75 TP1.TP

### Text on the board
tPlace: RW | RW | RO | RO